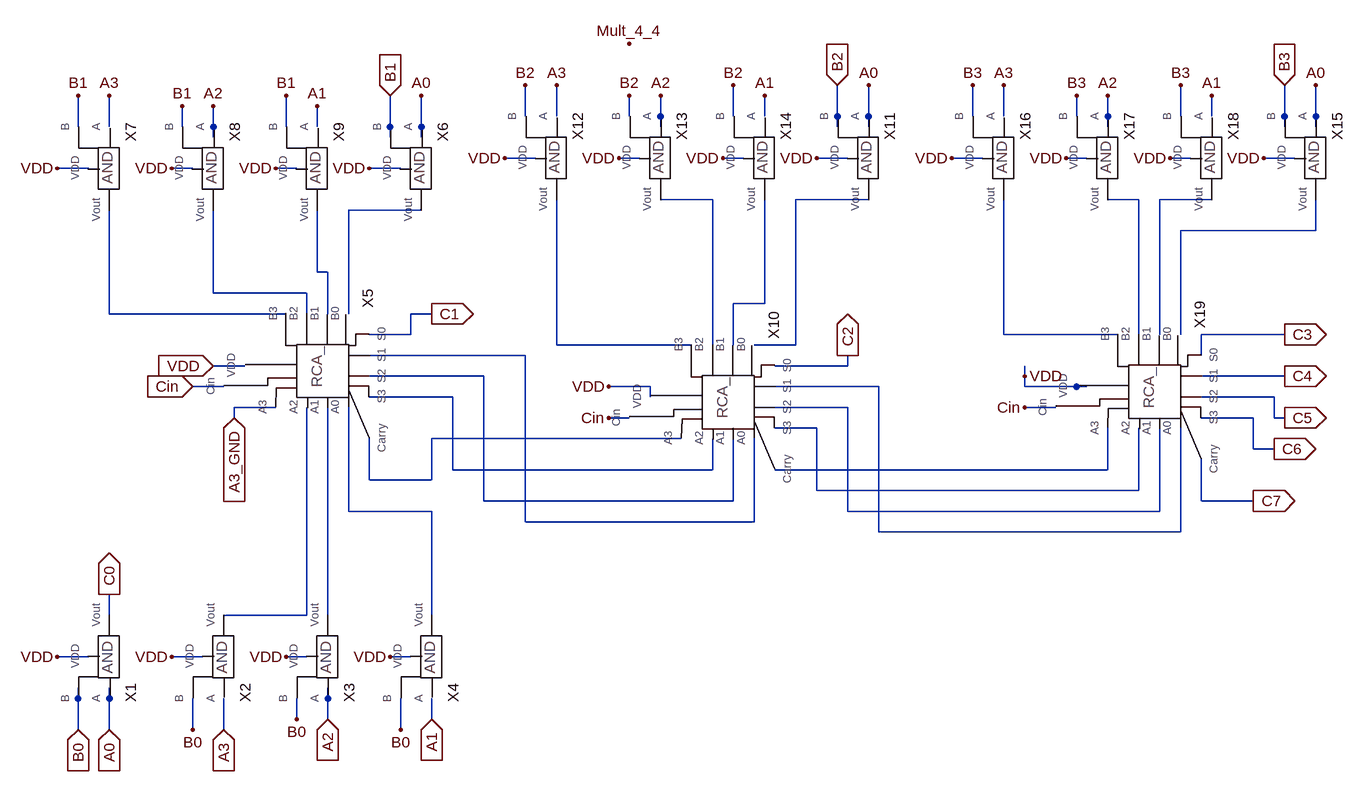
[diagram p0: schematic Mult_4_4.asc]
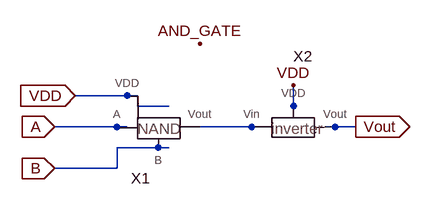
[diagram p1: sub-circuit and_gate.asc]
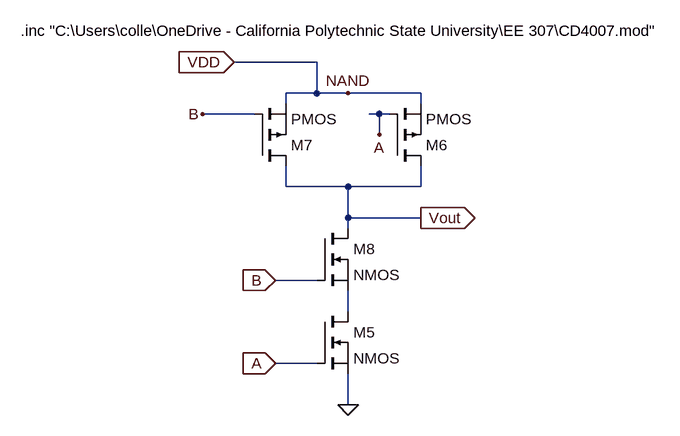
[diagram p2: sub-circuit nand_gate.asc]
Mult_4_4.asc, the LTspice schematic file:
Version 4
SHEET 1 1460 2044
WIRE 192 32 192 -16
WIRE 240 32 240 -16
WIRE 352 32 352 0
WIRE 400 32 400 0
WIRE 512 32 512 -16
WIRE 560 32 560 0
WIRE 672 32 672 -16
WIRE 720 32 720 -16
WIRE 880 32 880 -16
WIRE 928 32 928 -16
WIRE 1040 32 1040 0
WIRE 1088 32 1088 0
WIRE 1200 32 1200 -16
WIRE 1248 32 1248 0
WIRE 1360 32 1360 -16
WIRE 1408 32 1408 -16
WIRE -496 48 -496 0
WIRE -448 48 -448 0
WIRE -336 48 -336 16
WIRE -288 48 -288 16
WIRE -176 48 -176 0
WIRE -128 48 -128 16
WIRE -16 48 -16 0
WIRE 32 48 32 0
WIRE 400 48 400 32
WIRE 672 48 672 32
WIRE 720 48 720 32
WIRE 1088 48 1088 32
WIRE 1360 48 1360 32
WIRE 1408 48 1408 32
WIRE -288 64 -288 48
WIRE -16 64 -16 48
WIRE 32 64 32 48
WIRE 208 96 160 96
WIRE 368 96 336 96
WIRE 528 96 496 96
WIRE 688 96 640 96
WIRE 896 96 848 96
WIRE 1056 96 1024 96
WIRE 1216 96 1184 96
WIRE 1376 96 1328 96
WIRE -480 112 -528 112
WIRE -320 112 -352 112
WIRE -160 112 -192 112
WIRE 0 112 -48 112
WIRE 480 160 400 160
WIRE 720 160 608 160
WIRE 1136 160 1088 160
WIRE 1248 160 1168 160
WIRE 32 176 -80 176
WIRE 1408 208 1408 160
WIRE 1408 208 1200 208
WIRE -128 272 -128 176
WIRE -112 272 -128 272
WIRE -288 304 -288 176
WIRE -144 304 -288 304
WIRE 560 320 560 160
WIRE 560 320 512 320
WIRE -448 336 -448 176
WIRE -176 336 -448 336
WIRE -144 336 -144 304
WIRE -112 336 -112 272
WIRE -80 336 -80 176
WIRE 48 336 16 336
WIRE 16 368 16 336
WIRE 16 368 -48 368
WIRE 928 368 928 160
WIRE 1104 368 928 368
WIRE 1136 368 1136 160
WIRE 1168 368 1168 160
WIRE 1200 368 1200 208
WIRE 1360 368 1232 368
WIRE 240 384 240 160
WIRE 448 384 240 384
WIRE 480 384 480 160
WIRE 512 384 512 320
WIRE 608 384 608 160
WIRE 608 384 544 384
WIRE 192 400 -48 400
WIRE 1232 400 1232 368
WIRE -240 416 -288 416
WIRE 688 416 688 400
WIRE 688 416 576 416
WIRE 128 432 -48 432
WIRE 960 432 960 416
WIRE 1360 432 1232 432
WIRE -272 448 -320 448
WIRE 384 448 320 448
WIRE 736 448 576 448
WIRE 960 448 960 432
WIRE 1040 448 960 448
WIRE 1056 448 1040 448
WIRE 80 464 -48 464
WIRE 384 464 384 448
WIRE 1344 464 1232 464
WIRE -192 480 -256 480
WIRE 688 480 576 480
WIRE 1008 480 960 480
WIRE -256 496 -256 480
WIRE 352 496 320 496
WIRE 1312 496 1232 496
WIRE 1344 496 1344 464
WIRE 1360 496 1344 496
WIRE 640 512 576 512
WIRE 432 528 48 528
WIRE 1312 544 1312 496
WIRE 1344 544 1312 544
WIRE 80 576 80 464
WIRE 480 576 480 528
WIRE 480 576 80 576
WIRE 1088 576 1088 512
WIRE 1088 576 576 576
WIRE -48 592 -48 528
WIRE 48 592 48 528
WIRE 48 592 -48 592
WIRE 640 608 640 512
WIRE 1136 608 1136 512
WIRE 1136 608 640 608
WIRE 128 624 128 432
WIRE 512 624 512 528
WIRE 512 624 128 624
WIRE 1232 624 1232 560
WIRE 1312 624 1232 624
WIRE -80 640 -80 480
WIRE 48 640 -80 640
WIRE 688 640 688 480
WIRE 1168 640 1168 512
WIRE 1168 640 688 640
WIRE 192 656 192 400
WIRE 544 656 544 528
WIRE 544 656 192 656
WIRE 736 672 736 448
WIRE 1200 672 1200 512
WIRE 1200 672 736 672
WIRE -448 800 -448 768
WIRE -144 800 -144 480
WIRE -144 800 -272 800
WIRE -112 800 -112 480
WIRE 48 800 48 640
WIRE -480 864 -528 864
WIRE -304 864 -352 864
WIRE -144 864 -176 864
WIRE 16 864 -16 864
WIRE -496 928 -496 912
WIRE -448 928 -448 912
WIRE -112 928 -112 912
WIRE -160 960 -160 928
WIRE -112 960 -112 928
WIRE 48 960 48 928
WIRE -496 976 -496 928
WIRE -448 976 -448 928
WIRE -320 976 -320 928
WIRE -272 976 -272 928
WIRE 0 976 0 928
FLAG -496 976 B0
IOPIN -496 976 In
FLAG -320 976 B0
FLAG -160 960 B0
FLAG 0 976 B0
FLAG -448 976 A0
IOPIN -448 976 In
FLAG -272 976 A3
IOPIN -272 976 In
FLAG -112 960 A2
IOPIN -112 960 In
FLAG 48 960 A1
IOPIN 48 960 In
FLAG -352 864 VDD
FLAG -528 864 VDD
FLAG -176 864 VDD
FLAG -16 864 VDD
FLAG -288 416 VDD
IOPIN -288 416 In
FLAG -320 448 Cin
IOPIN -320 448 In
FLAG -256 496 A3_GND
IOPIN -256 496 In
FLAG -448 768 C0
IOPIN -448 768 Out
FLAG 48 336 C1
IOPIN 48 336 Out
FLAG 688 400 C2
IOPIN 688 400 Out
FLAG 1360 368 C3
IOPIN 1360 368 Out
FLAG 1360 432 C4
IOPIN 1360 432 Out
FLAG 1360 496 C5
IOPIN 1360 496 Out
FLAG -16 0 B1
IOPIN -16 0 In
FLAG -496 0 B1
FLAG -336 16 B1
FLAG -176 0 B1
FLAG 32 0 A0
FLAG -448 0 A3
FLAG -288 16 A2
FLAG -128 16 A1
FLAG -528 112 VDD
FLAG -48 112 VDD
FLAG -352 112 VDD
FLAG -192 112 VDD
FLAG 672 -16 B2
IOPIN 672 -16 In
FLAG 192 -16 B2
FLAG 352 0 B2
FLAG 512 -16 B2
FLAG 720 -16 A0
FLAG 240 -16 A3
FLAG 400 0 A2
FLAG 560 0 A1
FLAG 160 96 VDD
FLAG 640 96 VDD
FLAG 336 96 VDD
FLAG 496 96 VDD
FLAG 1344 544 C6
IOPIN 1344 544 Out
FLAG 320 496 Cin
FLAG 320 448 VDD
FLAG 1360 -16 B3
IOPIN 1360 -16 In
FLAG 880 -16 B3
FLAG 1040 0 B3
FLAG 1200 -16 B3
FLAG 1408 -16 A0
FLAG 928 -16 A3
FLAG 1088 0 A2
FLAG 1248 0 A1
FLAG 848 96 VDD
FLAG 1328 96 VDD
FLAG 1024 96 VDD
FLAG 1184 96 VDD
FLAG 960 480 Cin
FLAG 960 432 VDD
FLAG 1312 624 C7
IOPIN 1312 624 Out
FLAG 352 -80 Mult_4_4
SYMBOL AND_gate -448 832 R270
SYMATTR InstName X1
SYMBOL AND_gate -272 832 R270
SYMATTR InstName X2
SYMBOL AND_gate -112 832 R270
SYMATTR InstName X3
SYMBOL AND_gate 48 832 R270
SYMATTR InstName X4
SYMBOL RCA_ -80 432 R270
SYMATTR InstName X5
SYMBOL AND_gate 32 144 M90
SYMATTR InstName X6
SYMBOL AND_gate -448 144 M90
SYMATTR InstName X7
SYMBOL AND_gate -288 144 M90
SYMATTR InstName X8
SYMBOL AND_gate -128 144 M90
SYMATTR InstName X9
SYMBOL RCA_ 544 480 R270
SYMATTR InstName X10
SYMBOL AND_gate 720 128 M90
SYMATTR InstName X11
SYMBOL AND_gate 240 128 M90
SYMATTR InstName X12
SYMBOL AND_gate 400 128 M90
SYMATTR InstName X13
SYMBOL AND_gate 560 128 M90
SYMATTR InstName X14
SYMBOL AND_gate 1408 128 M90
SYMATTR InstName X15
SYMBOL AND_gate 928 128 M90
SYMATTR InstName X16
SYMBOL AND_gate 1088 128 M90
SYMATTR InstName X17
SYMBOL AND_gate 1248 128 M90
SYMATTR InstName X18
SYMBOL RCA_ 1200 464 R270
SYMATTR InstName X19

and_gate.asc, the sub-circuit schematic file:
Version 4
SHEET 1 880 680
WIRE 80 128 -16 128
WIRE 80 144 80 128
WIRE 128 144 80 144
WIRE 320 144 320 112
WIRE 320 160 320 144
WIRE 64 176 -48 176
WIRE 192 176 176 176
WIRE 256 176 192 176
WIRE 272 176 256 176
WIRE 384 176 368 176
WIRE 416 176 384 176
WIRE 128 208 48 208
WIRE 48 240 48 208
WIRE 48 240 -48 240
FLAG -16 128 VDD
IOPIN -16 128 In
FLAG -48 176 A
IOPIN -48 176 In
FLAG -48 240 B
IOPIN -48 240 In
FLAG 416 176 Vout
IOPIN 416 176 Out
FLAG 320 112 VDD
FLAG 176 48 AND_GATE
SYMBOL Nand_gate 160 192 R0
SYMATTR InstName X1
SYMBOL Inverter 352 192 R0
SYMATTR InstName X2

nand_gate.asc, the sub-circuit schematic file:
Version 4
SHEET 1 880 680
WIRE -224 -192 -352 -192
WIRE -224 -144 -224 -192
WIRE -224 -144 -272 -144
WIRE -176 -144 -224 -144
WIRE -64 -144 -176 -144
WIRE -272 -128 -272 -144
WIRE -64 -128 -64 -144
WIRE -320 -112 -400 -112
WIRE -128 -112 -144 -112
WIRE -112 -112 -128 -112
WIRE -128 -80 -128 -112
WIRE -272 0 -272 -32
WIRE -176 0 -272 0
WIRE -64 0 -64 -32
WIRE -64 0 -176 0
WIRE -176 48 -176 0
WIRE -64 48 -176 48
WIRE -176 64 -176 48
WIRE -224 144 -288 144
WIRE -176 192 -176 160
WIRE -224 272 -288 272
WIRE -176 336 -176 288
FLAG -176 -144 NAND
FLAG -176 336 0
FLAG -288 272 A
IOPIN -288 272 In
FLAG -128 -80 A
FLAG -400 -112 B
FLAG -288 144 B
IOPIN -288 144 In
FLAG -64 48 Vout
IOPIN -64 48 Out
FLAG -352 -192 VDD
IOPIN -352 -192 In
SYMBOL nmos -224 192 R0
SYMATTR InstName M5
SYMBOL pmos -112 -32 M180
SYMATTR InstName M6
SYMBOL pmos -320 -32 M180
SYMATTR InstName M7
SYMBOL nmos -224 64 R0
SYMATTR InstName M8
TEXT -680 -240 Left 2 !.inc "C:\\Users\\colle\\OneDrive - California Polytechnic State University\\EE 307\\CD4007.mod"

The netlist it stands for:
* Mult_4_4.asc
XX1 A0 VDD C0 B0 and_gate
XX2 A3 VDD N022 B0 and_gate
XX3 A2 VDD N023 B0 and_gate
XX4 A1 VDD N021 B0 and_gate
XX5 A3_GND N022 N023 N021 N016 N014 N013 C1 N019 N010 N008 VDD N007 N005 Cin RCA_  ; pins A3 A2 A1 A0 S3 S2 S1 S0 Carry B3 B2 VDD B1 B0 Cin
XX6 A0 VDD N005 B1 and_gate
XX7 A3 VDD N010 B1 and_gate
XX8 A2 VDD N008 B1 and_gate
XX9 A1 VDD N007 B1 and_gate
XX10 N019 N016 N014 N013 N018 N017 N015 C2 N020 N012 N001 VDD N009 N002 Cin RCA_  ; pins A3 A2 A1 A0 S3 S2 S1 S0 Carry B3 B2 VDD B1 B0 Cin
XX11 A0 VDD N002 B2 and_gate
XX12 A3 VDD N012 B2 and_gate
XX13 A2 VDD N001 B2 and_gate
XX14 A1 VDD N009 B2 and_gate
XX15 A0 VDD N006 B3 and_gate
XX16 A3 VDD N011 B3 and_gate
XX17 A2 VDD N003 B3 and_gate
XX18 A1 VDD N004 B3 and_gate
XX19 N020 N018 N017 N015 C6 C5 C4 C3 C7 N011 N003 VDD N004 N006 Cin RCA_  ; pins A3 A2 A1 A0 S3 S2 S1 S0 Carry B3 B2 VDD B1 B0 Cin

* block symbol definitions
.subckt and_gate A VDD Vout B
XX1 A B N001 VDD nand_gate
XX2 N001 VDD Vout Inverter  ; pins Vin VDD Vout
.ends and_gate

.subckt nand_gate A B Vout VDD
M5 N001 A 0 0 NMOS
M6 Vout A VDD VDD PMOS
M7 Vout B VDD VDD PMOS
M8 Vout B N001 N001 NMOS
.inc "C:\Users\colle\OneDrive - California Polytechnic State University\EE 307\CD4007.mod"
.ends nand_gate

.model NMOS NMOS
.model PMOS PMOS
.lib standard.mos
.backanno
.end